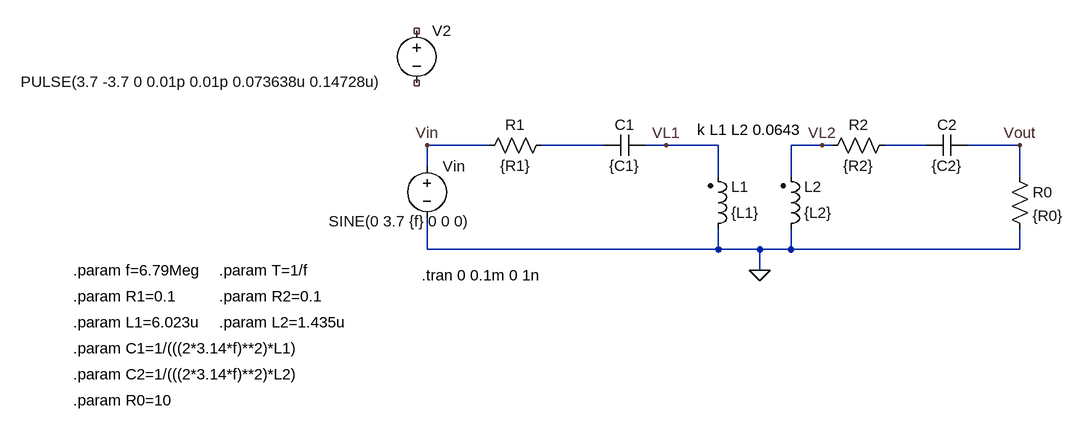
[diagram p0: schematic WPT_ideal.asc]
WPT_ideal.asc, the LTspice schematic file:
Version 4
SHEET 1 2368 796
WIRE 32 112 -64 112
WIRE 208 112 112 112
WIRE 304 112 272 112
WIRE 384 112 304 112
WIRE 544 112 496 112
WIRE 560 112 544 112
WIRE 704 112 640 112
WIRE 848 112 768 112
WIRE -64 144 -64 112
WIRE 384 160 384 112
WIRE 496 160 496 112
WIRE 848 160 848 112
WIRE -64 272 -64 224
WIRE 384 272 384 240
WIRE 384 272 -64 272
WIRE 448 272 384 272
WIRE 496 272 496 240
WIRE 496 272 448 272
WIRE 848 272 848 240
WIRE 848 272 496 272
WIRE 448 304 448 272
FLAG 448 304 0
FLAG -64 112 Vin
FLAG 848 112 Vout
FLAG 304 112 VL1
FLAG 544 112 VL2
SYMBOL voltage -64 128 R0
WINDOW 123 0 0 Left 0
WINDOW 39 0 0 Left 0
WINDOW 3 -151 101 Left 2
SYMATTR Value SINE(0 3.7 {f} 0 0 0)
SYMATTR InstName Vin
SYMBOL cap 272 96 R90
WINDOW 0 0 32 VBottom 2
WINDOW 3 32 32 VTop 2
SYMATTR InstName C1
SYMATTR Value {C1}
SYMBOL ind2 368 256 M180
WINDOW 0 36 80 Left 2
WINDOW 3 36 40 Left 2
SYMATTR InstName L1
SYMATTR Value {L1}
SYMATTR Type ind
SYMBOL ind2 480 256 M180
WINDOW 0 36 80 Left 2
WINDOW 3 36 40 Left 2
SYMATTR InstName L2
SYMATTR Value {L2}
SYMATTR Type ind
SYMBOL res 128 96 R90
WINDOW 0 0 56 VBottom 2
WINDOW 3 32 56 VTop 2
SYMATTR InstName R1
SYMATTR Value {R1}
SYMBOL res 656 96 R90
WINDOW 0 0 56 VBottom 2
WINDOW 3 32 56 VTop 2
SYMATTR InstName R2
SYMATTR Value {R2}
SYMBOL cap 768 96 R90
WINDOW 0 0 32 VBottom 2
WINDOW 3 32 32 VTop 2
SYMATTR InstName C2
SYMATTR Value {C2}
SYMBOL res 832 144 R0
SYMATTR InstName R0
SYMATTR Value {R0}
SYMBOL voltage -80 -80 R0
WINDOW 123 0 0 Left 0
WINDOW 39 0 0 Left 0
WINDOW 3 -609 94 Left 2
SYMATTR Value PULSE(3.7 -3.7 0 0.01p 0.01p 0.073638u 0.14728u)
SYMATTR InstName V2
TEXT 352 88 Left 2 !k L1 L2 0.0643
TEXT -72 312 Left 2 !.tran 0 0.1m 0 1n
TEXT -608 384 Left 2 !.param L1=6.023u
TEXT -608 344 Left 2 !.param R1=0.1
TEXT -608 424 Left 2 !.param C1=1/(((2*3.14*f)**2)*L1)
TEXT -608 304 Left 2 !.param f=6.79Meg
TEXT -384 304 Left 2 !.param T=1/f
TEXT -384 344 Left 2 !.param R2=0.1
TEXT -384 384 Left 2 !.param L2=1.435u
TEXT -608 464 Left 2 !.param C2=1/(((2*3.14*f)**2)*L2)
TEXT -608 504 Left 2 !.param R0=10

The netlist it stands for:
* WPT_ideal.asc
Vin Vin 0 SINE(0 3.7 {f} 0 0 0)
C1 VL1 N001 {C1}
L1 0 VL1 {L1}
L2 0 VL2 {L2}
R1 N001 Vin {R1}
R2 N002 VL2 {R2}
C2 Vout N002 {C2}
R0 Vout 0 {R0}
V2 NC_01 NC_02 PULSE(3.7 -3.7 0 0.01p 0.01p 0.073638u 0.14728u)
k L1 L2 0.0643
.tran 0 0.1m 0 1n
.param L1=6.023u
.param R1=0.1
.param C1=1/(((2*3.14*f)**2)*L1)
.param f=6.79Meg
.param T=1/f
.param R2=0.1
.param L2=1.435u
.param C2=1/(((2*3.14*f)**2)*L2)
.param R0=10
.backanno
.end